# EAGLE design remote_light_sensor (EAGLE 5.12)
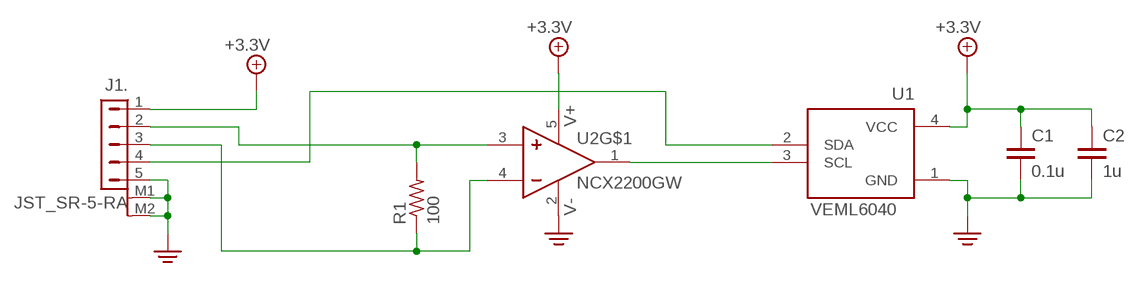
[diagram p0: schematic, sheet 1]

## Parts
C1  0.1u  C-CER-0603  [0603]
C2  1u  C-CER-0603  [0603]
J1  JST_SR-5-RA  [JST_SR-5-RA]
R1  100  R-0805  [0805]
U1  VEML6040  [VEML6040]
U2  NCX2200GW  [SOT353]

## Nets
3V3: C1.1 C2.1 J1.1 U1.4(VCC) U2.5(V+) ; supply symbol labelled +3.3V
GND: C1.2 C2.2 J1.5 J1.M1(M) J1.M2(M) U1.1(GND) U2.2(V-)
SCL: U1.3(SCL) U2.1(OUT)
SCL_N: J1.3 R1.1 U2.4(IN-)
SCL_P: J1.2 R1.2 U2.3(IN+)
SDA: J1.4 U1.2(SDA)

## Library data of the parts
C1 C2 = aim-passives:C-CER
J1 = aim-connectors:JST_SR-5
R1 = aim-passives:R
U1 = aim-sensors:VEML6040: Color sensor
U2 = aim-analog:NCX2200

## Board
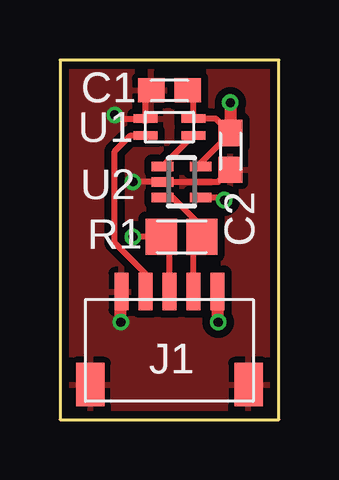
[diagram p1: board, top side]
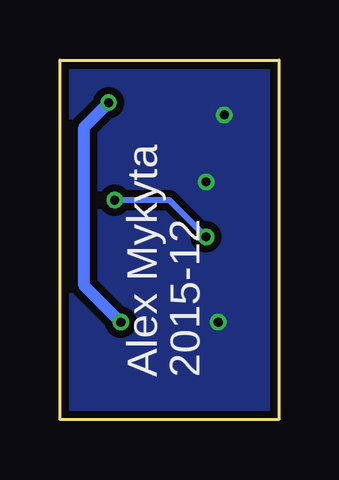
[diagram p2: board, bottom side, seen from below]

Size 9.14 x 14.99 mm. Coordinates in mm from the lower left corner, seen from the top.
Outline: 0,0 9.14,0 9.14,14.99 0,14.99 0,0
Copper layers (1*16): Top 0.035mm / dielectric 1.5mm / Bottom 0.035mm
Design rules "MakerStudio": minimum track width 6mil, minimum drill 12mil, track to track 6mil, track to pad 6mil, pad to pad 6mil, via to via 6mil, smd to smd 0mil, copper to edge 10mil, drill to drill 10mil, minimum pad ring 10mil, minimum via ring 6mil, stop-mask expansion 2mil, vias tented up to drill 100mil, thermal gap 10mil

### Footprints (pad centres in the part's own frame; a part is rotated, then mirrored left to right if it is on the bottom)
0603 = smd 1.1 x 1: 1 -0.762,0; 2 0.762,0
JST_SR-5-RA = smd 0.6 x 1.55: 1 2,4.575; 2 1,4.575; 3 0,4.575; 4 -1,4.575; 5 -2,4.575 | smd 1.2 x 1.8: M1 3.3,0.7; M2 -3.3,0.7
0805 = smd 1.3 x 1.5: 1 -0.85,0; 2 0.85,0
VEML6040 = smd 1 x 0.35: 1 -1,0.35; 2 -1,-0.35; 3 1,-0.35; 4 1,0.35
SOT353 = smd 0.4 x 0.9: 1 -0.65,-0.8; 2 0,-0.8; 3 0.65,-0.8; 4 0.65,0.8; 5 -0.65,0.8

### Placement (x,y rotation side)
C1  4.57,13.72 180 top
C2  7.11,11.18 270 top
J1  4.57,0.76 0 top
R1  5.08,7.62 0 top
U1  4.57,12.19 0 top
U2  5.08,9.91 270 top

### Tracks (layer width: path | path; a pad name or v marks a point on that pad's centre or on a via)
3V3  (via drill 0.38)
  Top 0.254: C1.1 5.57,13.48 U1.4 6.51,12.54 C2.1 5.88,10.71 U2.5 | 6.6,5.3 J1.1
  Top 0.508: v7.11,13.21 C2.1 | v6.6,4.06 6.6,5.3
  Bottom 0.508: v6.6,4.06 8.13,5.59 8.13,12.19 v7.11,13.21
GND  (via drill 0.38)
  Top 0.254: C1.2 3.57,13.48 U1.1 2.44,12.54 v2.29,12.7 | C2.2 6.6,9.91 U2.2 v3.05,9.91
  Top 0.508: J1.5 2.54,5.3 v2.54,4.06
  pour Bottom (isolate 0.305): 0,14.99 9.14,14.99 9.14,0 0,0
  pour Top (isolate 0.305): 0,14.99 9.14,14.99 9.14,0 0,0
SCL
  Top 0.254: U2.1 U1.3
SCL_N  (via drill 0.38)
  Top 0.254: J1.3 4.57,7.28 R1.1 v3.05,7.62 | U2.4 6.75,9.26 v6.86,9.14
  Bottom 0.254: v6.86,9.14 4.57,9.14 v3.05,7.62
SCL_P
  Top 0.254: J1.2 5.57,7.26 R1.2 5.93,8.04 4.71,9.26 U2.3
SDA
  Top 0.254: J1.4 3.57,6.08 2.29,7.37 2.29,11.18 2.95,11.84 U1.2

### Text on the board
_bPlace: 2015-12 | Alex Mykyta
_tNames: C1 | U1 | C2 | U2 | R1 | J1